# Altium schematic sheet TYPEC_PWR.SchDoc
size A2; DrawnBy: UKAYACIK; Engineer: UKAYACIK; DocumentNumber: 15; SheetNumber: 15; SheetTotal: 21
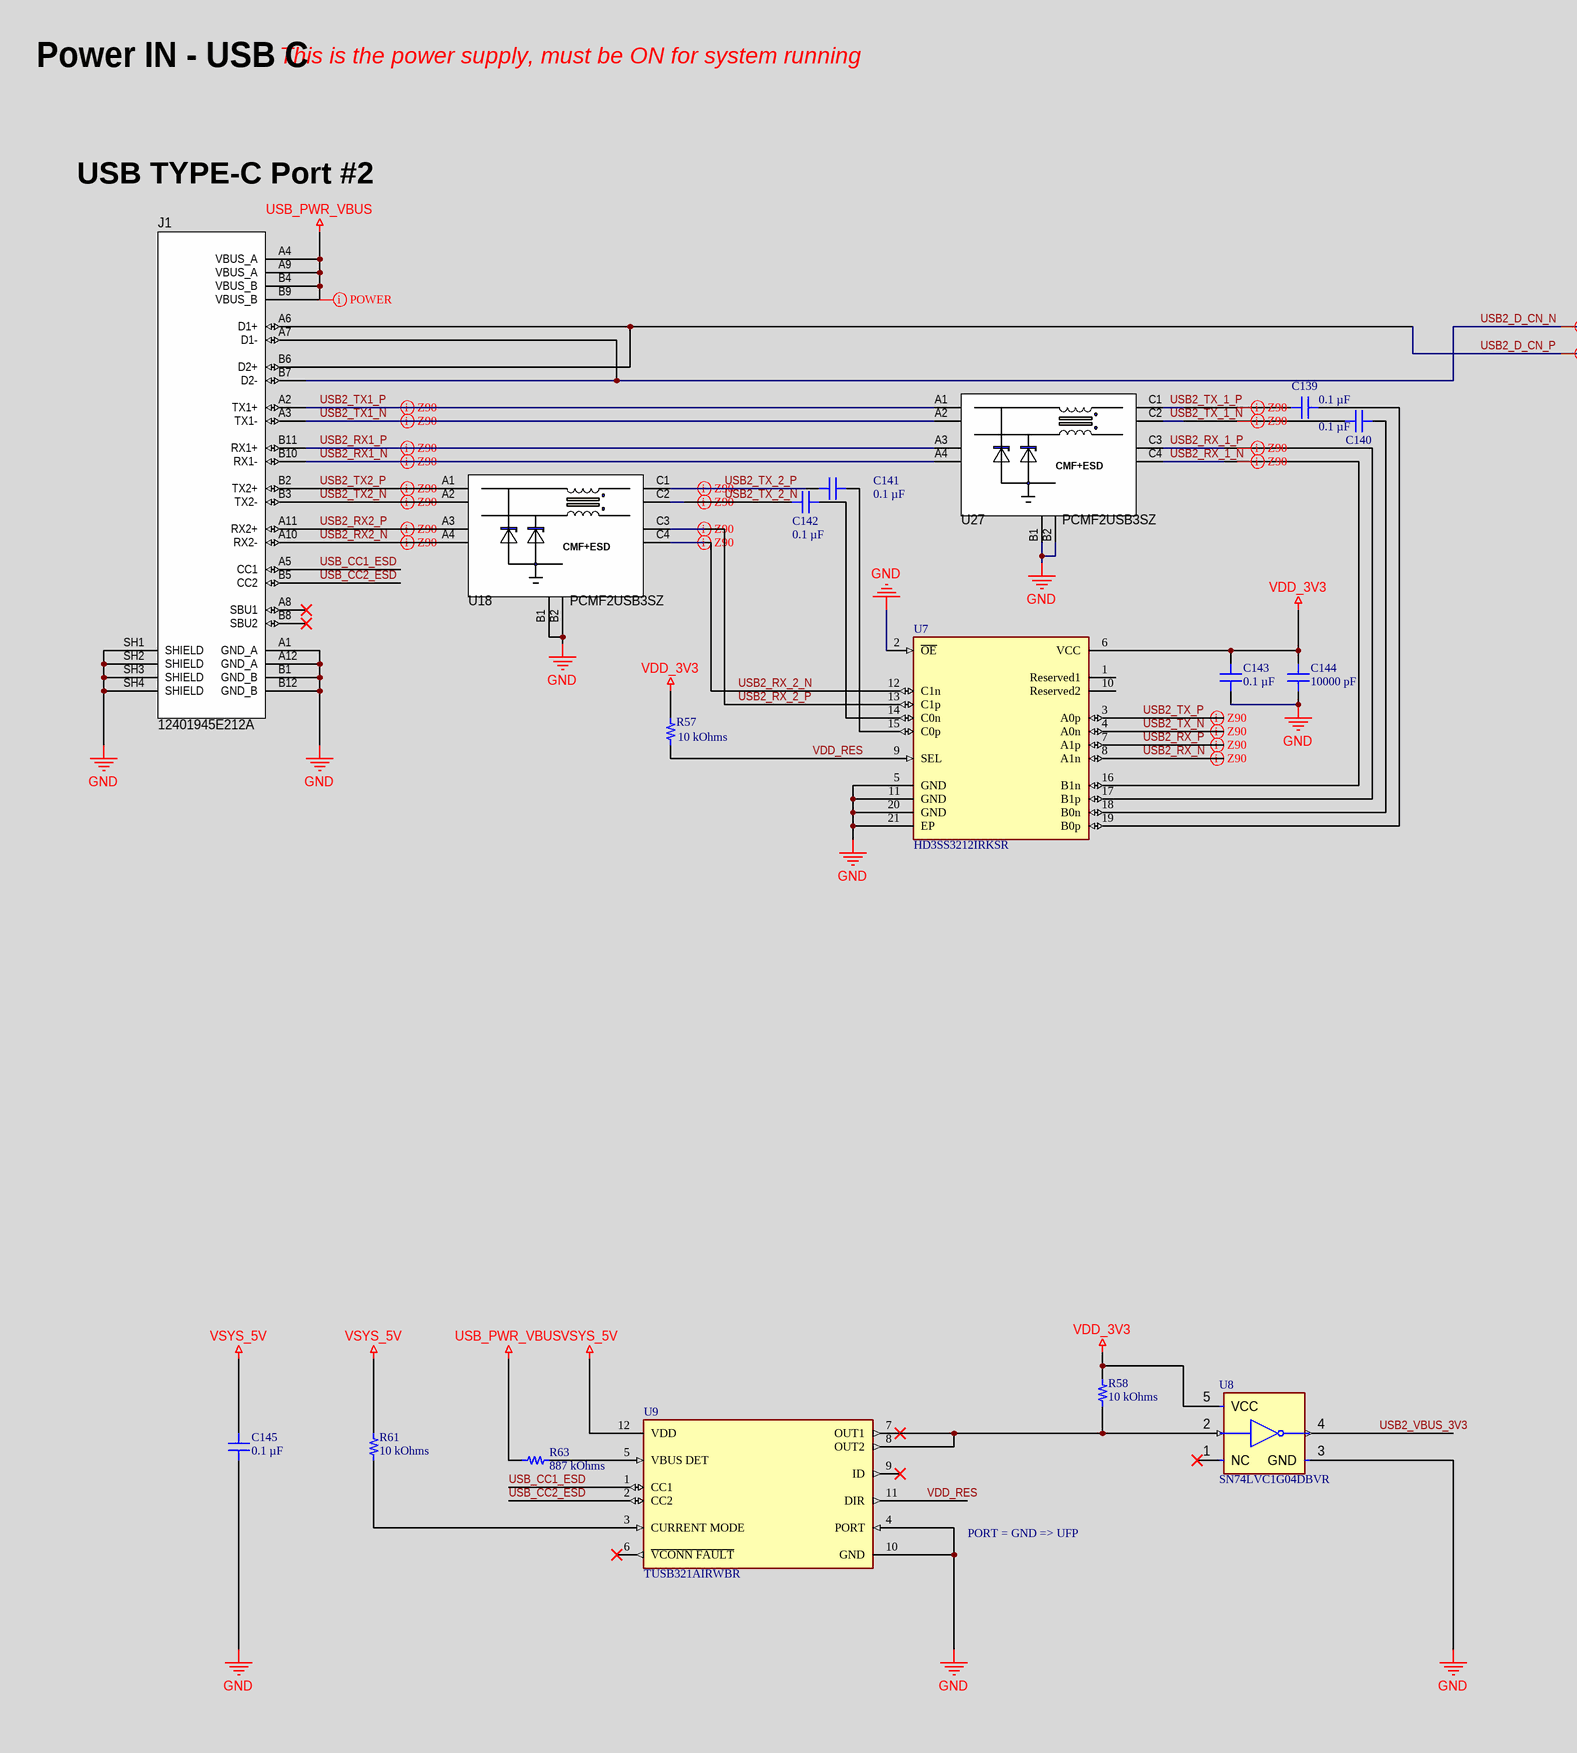
[diagram p0: TYPEC_PWR.SchDoc, left]
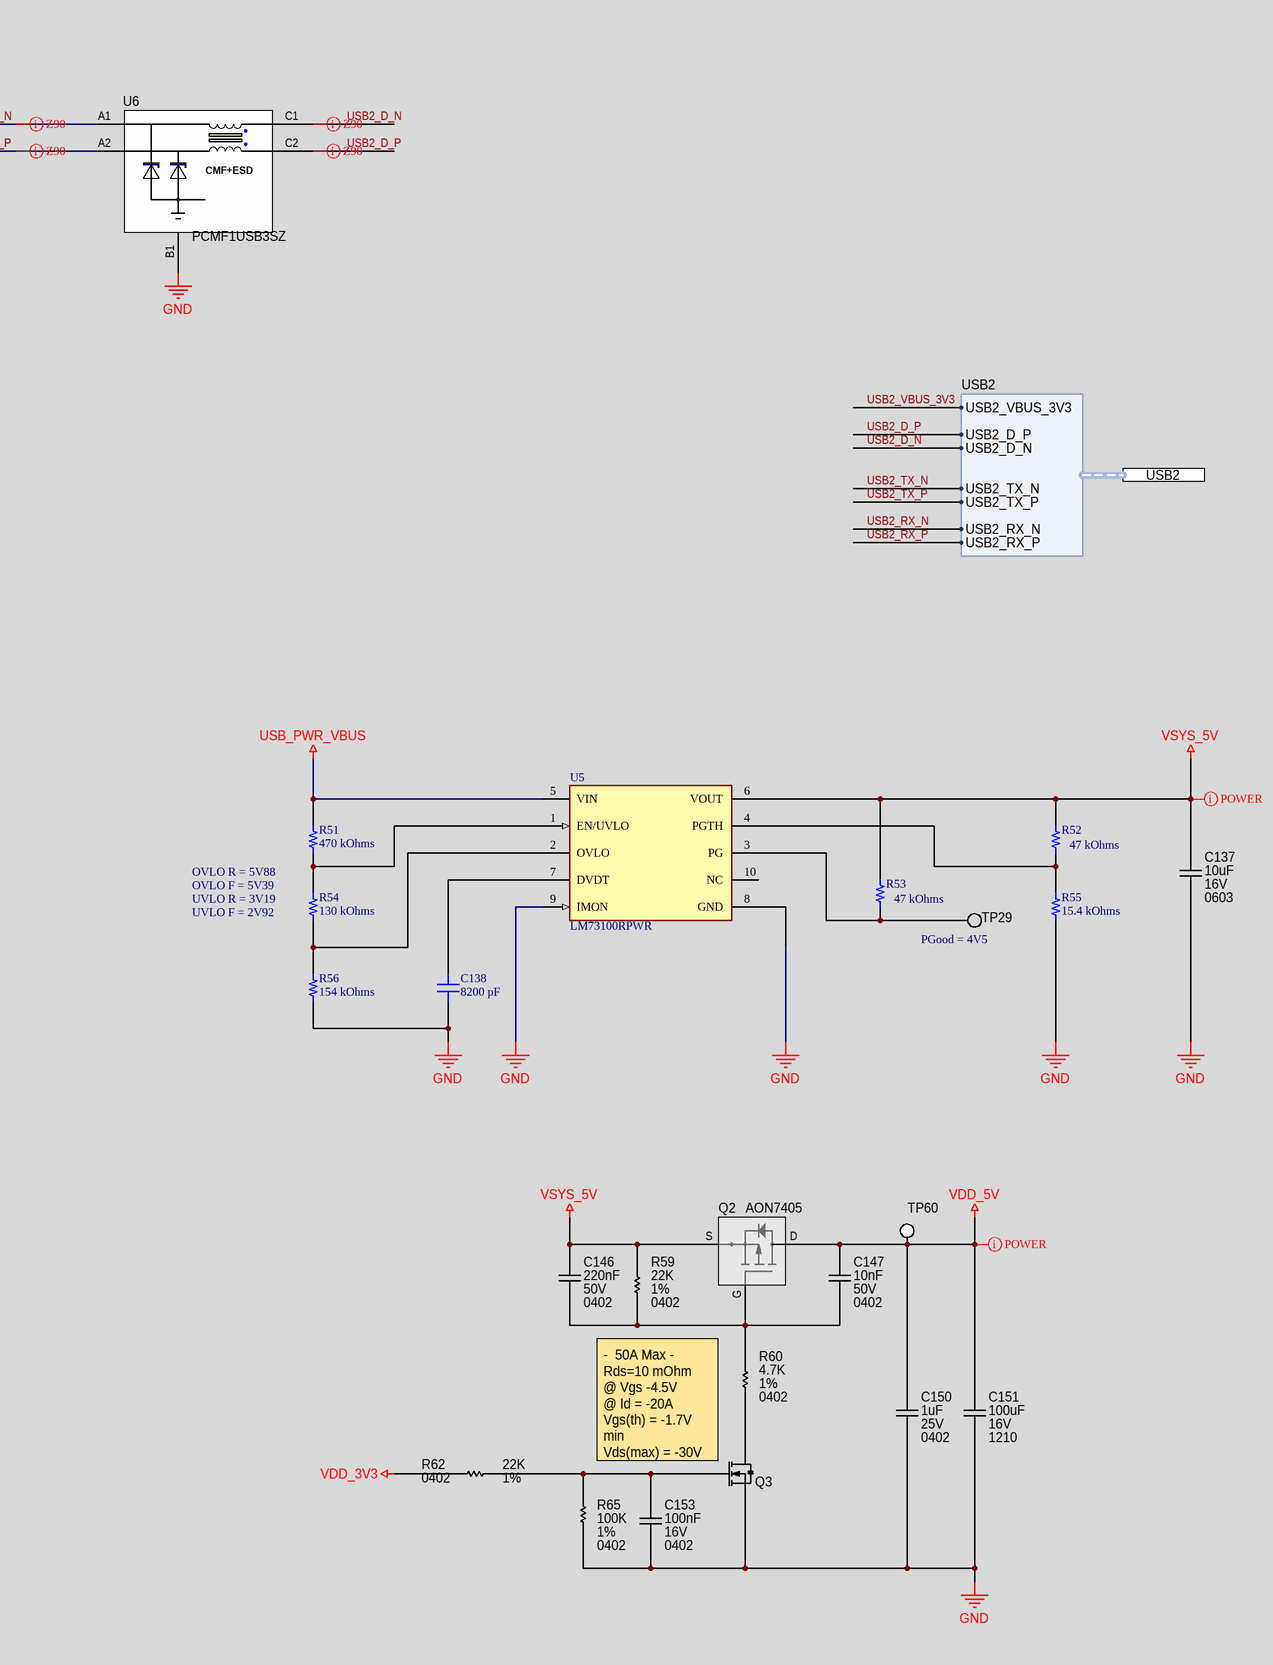
[diagram p1: TYPEC_PWR.SchDoc, right]

## Parts
C137  Voltage Rating: 16V  Capacitance: 10uF  Case/Package: 0603  [CAP_0603_CAPC1608X08N]  (hidden comment: GRM188R61C106MAALD)
C138  8200 pF  [CAP 0402_1005]
C139  0.1 µF  [MURATA GCM155 0402_1005]
C140  0.1 µF  [MURATA GCM155 0402_1005]
C141  0.1 µF  [MURATA GCM155 0402_1005]
C142  0.1 µF  [MURATA GCM155 0402_1005]
C143  0.1 µF  [MURATA GCM155 0402_1005]
C144  10000 pF  [CAP 0402_1005]
C145  0.1 µF  [MURATA GCM155 0402_1005]
C146  Case/Package: 0402  Voltage Rating (DC): 50V  Capacitance: 220nF  [CAP_0402_CAPC1005X05N]  (hidden comment: GRM155R61H224KE01W)
C147  Voltage Rating: 50V  Capacitance: 10nF  Case/Package: 0402  [CAP_0402_CAPC1005X05N]  (hidden comment: GRM155R71H103KA88D)
C150  Voltage Rating: 25V  Capacitance: 1uF  Case Code (Imperial): 0402  [CAP_0402_CAPC1005X05N]  (hidden comment: GRM155R61E105KA12D)
C151  Voltage Rating: 16V  Capacitance: 100uF  Case/Package: 1210  [CAP_1210_CAPC3225X270N]  (hidden comment: EMK325ABJ107MM-T)
C153  Voltage Rating: 16V  Capacitance: 100nF  Case/Package: 0402  [CAP_0402_CAPC1005X05N]  (hidden comment: CL05B104KO5NNNC)
J1  12401945E212A  [CONN_USBC_AMPHENOL_12401945E212A]
Q2  AON7405  [TRANS_AON7405]
Q3  NX3008NBKW,115  [TRANS_FET_SOT65P210X110-3N]  (value not drawn)
R51  470 kOhms  [RES 0402_1005]
R52  47 kOhms  [RES 0402_1005]
R53  47 kOhms  [RES 0402_1005]
R54  130 kOhms  [YAGEO RES 0402_1005]
R55  15.4 kOhms  [RES 0402_1005]
R56  154 kOhms  [RES 0402_1005]
R57  10 kOhms  [RES 0402_1005]
R58  10 kOhms  [RES 0402_1005]
R59  Tolerance: 1%  Resistance: 22K  Case/Package: 0402  [RES_0402_RESC1005X04N]  (hidden comment: ERJ-2RKF2202X)
R60  Tolerance: 1%  Case Code (Imperial): 0402  Resistance: 4.7K  [RES_0402_RESC1005X04N]  (hidden comment: ERJ-2RKF4701X)
R61  10 kOhms  [RES 0402_1005]
R62  Tolerance: 1%  Resistance: 22K  Case/Package: 0402  [RES_0402_RESC1005X04N]  (hidden comment: ERJ-2RKF2202X)
R63  887 kOhms  [RES 0805_2012]
R65  Resistance: 100K  Tolerance: 1%  Case/Package: 0402  [RES_0402_RESC1005X04N]  (hidden comment: RC0402FR-07100KL)
TP29  NO COMPONENT  [TP_PAD_0.5MM_SMD_ROUND]  (value not drawn)  (no BOM)
TP60  NO COMPONENT  [TP_PAD_0.8MM_SMD_ROUND]  (value not drawn)  (no BOM)
U5  LM73100RPWR  [FP-RPW0010A-MFG]
U6  PCMF1USB3SZ  [ESD_PESD1USB3BCX]
U7  HD3SS3212IRKSR  [FP-RKS0020A-MFG]
U8  SN74LVC1G04DBVR  [FP-DBV0005A-MFG]
U9  TUSB321AIRWBR  [FP-RWB0012A-MFG]
U18  PCMF2USB3SZ  [ESD_PCMF2USB3SZ]
U27  PCMF2USB3SZ  [ESD_PCMF2USB3SZ]

## Ports
USB2 (harness USB2)

## Harnesses
USB2: USB2_VBUS_3V3, USB2_TX_N, USB2_TX_P, USB2_RX_N, USB2_RX_P, USB2_D_N, USB2_D_P

## Nets
GND: C137.1 C138.1 C143.1 C144.1 C145.1 C150.1 C151.1 C153.1 J1.A1(GND_A) J1.A12(GND_A) J1.B1(GND_B) J1.B12(GND_B) J1.SH1(SHIELD) J1.SH2(SHIELD) J1.SH3(SHIELD) J1.SH4(SHIELD) Q3.S R55.1 R56.1 R65.1 U5.8(GND) U5.9(IMON) U6.B1(ground_channel_1) U7.2(~{OE}) U7.5(GND) U7.11(GND) U7.20(GND) U7.21(EP) U8.3(GND) U9.4(PORT) U9.10(GND) U18.B1(GND_CH1) U18.B2(GND_CH2) U27.B1(GND_CH1) U27.B2(GND_CH2)
USB_PWR_VBUS: J1.A4(VBUS_A) J1.A9(VBUS_A) J1.B4(VBUS_B) J1.B9(VBUS_B) R51.2 R63.1 U5.5(VIN)
VDD_3V3: C143.2 C144.2 R57.2 R58.2 R62.1 U7.6(VCC) U8.5(VCC)
VDD_5V: C147.2 C150.2 C151.2 Q2.D TP60.1
VSYS_5V: C137.2 C145.2 C146.2 Q2.S R52.2 R53.2 R59.2 R61.2 U5.6(VOUT) U9.12(VDD)
USB2_D_CN_N: J1.A7(D1-) J1.B7(D2-) U6.A1(channel_1+_external)
USB2_D_CN_P: J1.A6(D1+) J1.B6(D2+) U6.A2(channel_1-_external)
USB2_D_N: U6.C1(channel_1+_internal) ; port USB2.USB2_D_N
USB2_D_P: U6.C2(channel_1-_internal) ; port USB2.USB2_D_P
USB2_RX1_N: J1.B10(RX1-) U27.A4(CH2_IN-)
USB2_RX1_P: J1.B11(RX1+) U27.A3(CH2_IN+)
USB2_RX2_N: J1.A10(RX2-) U18.A4(CH2_IN-)
USB2_RX2_P: J1.A11(RX2+) U18.A3(CH2_IN+)
USB2_RX_1_N: U7.16(B1n) U27.C4(CH2_OUT-)
USB2_RX_1_P: U7.17(B1p) U27.C3(CH2_OUT+)
USB2_RX_2_N: U7.12(C1n) U18.C4(CH2_OUT-)
USB2_RX_2_P: U7.13(C1p) U18.C3(CH2_OUT+)
USB2_RX_N: U7.8(A1n) ; port USB2.USB2_RX_N
USB2_RX_P: U7.7(A1p) ; port USB2.USB2_RX_P
USB2_TX1_N: J1.A3(TX1-) U27.A2(CH1_IN-)
USB2_TX1_P: J1.A2(TX1+) U27.A1(CH1_IN+)
USB2_TX2_N: J1.B3(TX2-) U18.A2(CH1_IN-)
USB2_TX2_P: J1.B2(TX2+) U18.A1(CH1_IN+)
USB2_TX_1_N: C140.1 U27.C2(CH1_OUT-)
USB2_TX_1_P: C139.1 U27.C1(CH1_OUT+)
USB2_TX_2_N: C142.1 U18.C2(CH1_OUT-)
USB2_TX_2_P: C141.1 U18.C1(CH1_OUT+)
USB2_TX_N: U7.4(A0n) ; port USB2.USB2_TX_N
USB2_TX_P: U7.3(A0p) ; port USB2.USB2_TX_P
USB2_VBUS_3V3: U8.4(Y) ; port USB2.USB2_VBUS_3V3
USB_CC1_ESD: J1.A5(CC1) U9.1(CC1)
USB_CC2_ESD: J1.B5(CC2) U9.2(CC2)
VDD_RES: R57.1 U7.9(SEL) U9.11(DIR)
NetC138_2: C138.2 U5.7(DVDT)
NetC139_2: C139.2 U7.19(B0p)
NetC140_2: C140.2 U7.18(B0n)
NetC141_2: C141.2 U7.15(C0p)
NetC142_2: C142.2 U7.14(C0n)
NetC146_1: C146.1 C147.1 Q2.G R59.1 R60.2
NetC153_2: C153.2 Q3.G R62.2 R65.2
NetQ3_D: Q3.D R60.1
NetR51_1: R51.1 R54.2 U5.1(EN/UVLO)
NetR52_1: R52.1 R55.2 U5.4(PGTH)
NetR53_1: R53.1 TP29.1 U5.3(PG)
NetR54_1: R54.1 R56.2 U5.2(OVLO)
NetR58_1: R58.1 U8.2(A) U9.7(OUT1) U9.8(OUT2)
NetR61_1: R61.1 U9.3(CURRENT_MODE)
NetR63_2: R63.2 U9.5(VBUS_DET)

Not connected (* = marked no-connect by the designer): J1 A8(SBU1)* B8(SBU2)*; U5 10(NC); U7 1(Reserved1) 10(Reserved2); U8 1(NC)*; U9 6(~{VCONN_FAULT})* 9(ID)*

## Layout directives
differential pair; differential pair class Z90: USB2_D_CN_N, USB2_D_CN_P, USB2_D_N, USB2_D_P, USB2_RX1_N, USB2_RX1_P, USB2_RX2_N, USB2_RX2_P, USB2_RX_1_N, USB2_RX_1_P, USB2_RX_2_N, USB2_RX_2_P, USB2_RX_N, USB2_RX_P, USB2_TX1_N, USB2_TX1_P, USB2_TX2_N, USB2_TX2_P, USB2_TX_1_N, USB2_TX_1_P, USB2_TX_2_N, USB2_TX_2_P, USB2_TX_N, USB2_TX_P
net class POWER: USB_PWR_VBUS, VDD_5V, VSYS_5V

## Notes on the sheet
- Power IN - USB C
- This is the power supply, must be ON for system running
- USB TYPE-C Port #2
- OVLO R = 5V88
- OVLO F = 5V39
- UVLO R = 3V19
- (near R54) UVLO F = 2V92
- (near TP29) PGood = 4V5
- PORT = GND => UFP
- (near Q3) -  50A Max -
  Rds=10 mOhm
  @ Vgs -4.5V
  @ Id = -20A
  Vgs(th) = -1.7V min
  Vds(max) = -30V
- PCB Des :
- Approv By :
- Project Title :
- Sheet Title :
- Date :
- Page :
- PCB Version :
- PCB Revision :
- Size :
- A2
- (in symbol ESD_EMI_PCMF1USB3SZ) CMF+ESD
- (in symbol ESD_EMI_PCMF2USB3SZ) CMF+ESD

## Library data of the parts
C137 = CAP_10UF_16V_X5R_0603: 0603 10 uF 16 V ±20% Tolerance X5R Multilayer Ceramic Chip Capacitor; Manufacturer: Murata; Manufacturer Part Number: GRM188R61C106MAALD; RoHS: Yes; Category: Ceramic Capacitors; Stock 1: 566627; Pricing 1: 1=0.24000, 10=0.16500, 50=0.11000, 100=0.09340, 500=0.06596, 1000=0.05771 (USD); Mount: Surface Mount; Case Code (Metric): 1608; Material: Ceramic; Case Code (Imperial): 0603; Min Operating Temperature: -55°C; Max Operating Temperature: 85°C; Tolerance: 20%; Packaging: Cut Tape; Voltage Rating (DC): 16V; Length: 0.063inch; Width: 0.031inch; Height: 0.8mm; Thickness: 0.037inch; Lead Free: Lead Free; RoHS Compliant: Yes; ComponentLink1URL: http://search.murata.co.jp/Ceramy/image/img/A01X/G101/ENG/GRM188R61C106MAAL-01.pdf?src-supplier=Digi-Key; ComponentLink1Description: http://search.murata.co.jp/Ceramy/image/img/A01X/G101/ENG/GRM188R61C106MAAL-01.pdf?src-supplier=Digi-Key; ComponentLink2URL: https://search.murata.co.jp/Ceramy/image/img/A01X/G101/ENG/GRM188R61C106MAAL-01.pdf?src-supplier=Digi-Key; ComponentLink2Description: https://search.murata.co.jp/Ceramy/image/img/A01X/G101/ENG/GRM188R61C106MAAL-01.pdf?src-supplier=Digi-Key; ComponentLink3URL: http://search.murata.co.jp/Ceramy/image/img/A01X/partnumbering_e_01.pdf?src-supplier=Digi-Key; ComponentLink3Description: http://search.murata.co.jp/Ceramy/image/img/A01X/partnumbering_e_01.pdf?src-supplier=Digi-Key; Supplier 1: Digi-Key; Supplier 2: Verical; Supplier 3: Mouser; Supplier Part Number 1: 490-10729-1-ND; Supplier Part Number 2: GRM188R61C106MAALD; Supplier Part Number 3: 81-GRM188R61C106MALD
C138 = C0402C822J1RACTU: CAP CER 0402 8.2NF 100VDC X7R; manufacturer: KEMET; Tolerance: ±5%; Voltage - Rated: 100V; Part Number: C0402C822J1RACTU; Capacitance: 8200 pF; Applications: Bypass, Decoupling; componentlink1description: Datasheet; componentlink1url: https://connect.kemet.com:7667/gateway/IntelliData-ComponentDocumentation/1.0/download/datasheet/C0402C822J1RACTU; componentlink2description: DigiKey Link; componentlink2url: https://www.digikey.com/en/products/detail/kemet/C0402C822J1RACTU/19200683; Device Package: 0402 (1005 Metric); lastupdated: 2/9/2024 8:03:16 PM; Lifecycle Status: Active; Minimum Order: 1; Mounting Type: Surface Mount, MLCC; Operating Temperature: -55°C ~ 125°C; Package / Case: 0402 (1005 Metric); packaging: TapeAndReel; partid: 57252; price: 0.02; series: SMD Comm X7R; Size / Dimension: 0.039" L x 0.020" W (1.00mm x 0.50mm); Supplier 1: DigiKey; Supplier Part Number 1: 399-C0402C822J1RACTUCT-ND; Temperature Coefficient: X7R; Thickness (Max): 0.022" (0.55mm); value: 8200 pF
C139-C143 C145 = GCM155R71E104KE02D: CAP CER 0.1UF 25V X7R 0402; manufacturer: Murata Electronics; Tolerance: ±10%; Part Number: GCM155R71E104KE02D; Capacitance: 0.1 µF; Applications: Automotive; componentlink1description: Datasheet; componentlink1url: https://search.murata.co.jp/Ceramy/image/img/A01X/G101/ENG/GCM155R71E104KE02-01.pdf; componentlink2description: DigiKey Link; componentlink2url: https://www.digikey.com/en/products/detail/murata-electronics/GCM155R71E104KE02D/7363175; Device Package: 0402 (1005 Metric); lastupdated: 7/20/2024 2:04:19 AM; Lifecycle Status: Active; Minimum Order: 1; Mounting Type: Surface Mount, MLCC; Operating Temperature: -55°C ~ 125°C; Package / Case: 0402 (1005 Metric); packaging: TapeAndReel; partid: 2051; Part Status: Active; price: 0.01; Ratings: AEC-Q200; series: GCM; Size / Dimension: 0.039" L x 0.020" W (1.00mm x 0.50mm); Supplier 1: DigiKey; Supplier Part Number 1: 490-16431-1-ND; Temperature Coefficient: X7R; Thickness (Max): 0.022" (0.55mm); value: 0.1 µF; Voltage - Rated: 25V
C144 = C0402C103M5RECAUTO: CAP CER 0402 10NF 50V X7R 20%; manufacturer: KEMET; Part Number: C0402C103M5RECAUTO; Capacitance: 10000 pF; Applications: Automotive, ESD Protection; componentlink1description: Datasheet; componentlink1url: https://api.kemet.com/component-edge/download/datasheet/C0402C103M5RECAUTO.pdf; componentlink2description: DigiKey Link; componentlink2url: https://www.digikey.com/en/products/detail/kemet/C0402C103M5RECAUTO/8646509; Device Package: 0402 (1005 Metric); lastupdated: 2/9/2024 8:04:13 PM; Lifecycle Status: Active; Minimum Order: 1; Mounting Type: Surface Mount, MLCC; Operating Temperature: -55°C ~ 125°C; Package / Case: 0402 (1005 Metric); packaging: TapeAndReel; partid: 33125; Part Status: Active; price: 0.01; Ratings: AEC-Q200; series: ESD SMD Auto X7R; Size / Dimension: 0.039" L x 0.020" W (1.00mm x 0.50mm); Supplier 1: DigiKey; Supplier Part Number 1: 399-C0402C103M5RECAUTOCT-ND; Temperature Coefficient: X7R; Thickness (Max): 0.022" (0.55mm); Tolerance: ±20%; value: 10000 pF; Voltage - Rated: 50V
C146 = CAP_0.22UF_50V_X5R_0402: Multilayer Ceramic Capacitor, 0.22 uF, 50 VDC, ± 10%, X5R, 0402 [1005 Metric]; Manufacturer: Murata; Material: 4241ConductorMaterial; Dielectric: 1537DielectricType; Supplier 1: Digi-Key; Manufacturer Part Number: GRM155R61H224KE01W; RoHS: No; Category: Ceramic Capacitors; Stock 1: 74638; Pricing 1: 1=0.1, 10=0.048, 50=0.0272, 100=0.0212, 500=0.01592, 1000=0.01251, 2500=0.01138, 5000=0.01046 (USD); Min Operating Temperature: -55°C; Max Operating Temperature: 85°C; Voltage Rating: 50V; Length: 1mm; Width: 500um; Height: 550um; Thickness: 500um; Supplier Part Number 1: 490-GRM155R61H224KE01WCT-ND
C147 = CAP_10nF_50V_X7R_0402: Multilayer Ceramic Capacitors MLCC Surface Mount 0402 0.01uF 50 Volts X7R 10%; Manufacturer: Murata; Voltage: 25V; Supplier 1: Digikey; Manufacturer Part Number: GRM155R71H103KA88D; RoHS: Yes; Category: Ceramic Capacitors; Stock 1: 5190059; Pricing 1: 1=0.1, 10=0.023, 50=0.013, 100=0.0101, 500=0.0076, 1000=0.00598, 2500=0.00543, 5000=0.005 (USD); Mount: Surface Mount; Number of Pins: 2; Case Code (Metric): 1005; Case Code (Imperial): 0402; Material: Ceramic; Min Operating Temperature: -55°C; Max Operating Temperature: 125°C; Tolerance: 10%; Packaging: Tape and Reel; Package Quantity: 1; Dielectric: X7R; Termination: SMD/SMT; Series: GRM; Construction: Flat; Voltage Rating (DC): 50V; Length: 1mm; Width: 0.02inch; Height: 0.5mm; Thickness: 0.022inch; Depth: 0.5mm; Radiation Hardening: No; Reach SVHC Compliant: No; RoHS Compliant: Yes; Lead Free: 5697LeadFree; ComponentLink1URL: https://datasheet.ciiva.com/22698/1747449-22698420.pdf?src-supplier=Element14; ComponentLink1Description: https://datasheet.ciiva.com/22698/1747449-22698420.pdf?src-supplier=Element14; ComponentLink2URL: https://datasheet.ciiva.com/19476/1856433-19476546.pdf?src-supplier=Jameco; ComponentLink2Description: https://datasheet.ciiva.com/19476/1856433-19476546.pdf?src-supplier=Jameco; ComponentLink3URL: https://datasheet.ciiva.com/129/product-129810.pdf?src-supplier=Digikey; ComponentLink3Description: https://datasheet.ciiva.com/129/product-129810.pdf?src-supplier=Digikey; ComponentLink4URL: https://datasheet.ciiva.com/11786/0900766b80ef921d-11786340.pdf?src-supplier=Rs; ComponentLink4Description: https://datasheet.ciiva.com/11786/0900766b80ef921d-11786340.pdf?src-supplier=Rs; ComponentLink5URL: https://datasheet.ciiva.com/18100/getdatasheetpartid-27434-18100660.pdf?src-supplier=Verical; ComponentLink5Description: https://datasheet.ciiva.com/18100/getdatasheetpartid-27434-18100660.pdf?src-supplier=Verical; ComponentLink6URL: https://datasheet.ciiva.com/29199/454225-da-01-en-vs-kondensator-0402-29199740.pdf?src-supplier=Conrad; ComponentLink6Description: https://datasheet.ciiva.com/29199/454225-da-01-en-vs-kondensator-0402-29199740.pdf?src-supplier=Conrad; ComponentLink7URL: https://datasheet.ciiva.com/129/grm155r71h103ka88-01-129811.pdf?src-supplier=Digikey; ComponentLink7Description: https://datasheet.ciiva.com/129/grm155r71h103ka88-01-129811.pdf?src-supplier=Digikey; ComponentLink8URL: https://datasheet.ciiva.com/129/grm155r71h103ka88-01-129812.pdf?src-supplier=Digikey; ComponentLink8Description: https://datasheet.ciiva.com/129/grm155r71h103ka88-01-129812.pdf?src-supplier=Digikey; ComponentLink9URL: https://datasheet.ciiva.com/5410/product-5410990.pdf?src-supplier=Mouser; ComponentLink9Description: https://datasheet.ciiva.com/5410/product-5410990.pdf?src-supplier=Mouser; ComponentLink10URL: https://datasheet.ciiva.com/16495/product-16495290.pdf?src-supplier=Future+Electronics; ComponentLink10Description: https://datasheet.ciiva.com/16495/product-16495290.pdf?src-supplier=Future+Electronics; Supplier Part Number 1: 490-4516-6-ND
C150 = CAP_1UF_25V_X5R_0402: Multilayer Ceramic Capacitor, 1 uF, 25 V, ± 10%, X5R, 0402 [1005 Metric]; Manufacturer: Murata; Supplier 1: Digi-Key; Manufacturer Part Number: GRM155R61E105KA12D; RoHS: Yes; Category: Ceramic Capacitors; Stock 1: 849086; Pricing 1: 1=0.1, 10=0.043, 50=0.0246, 100=0.019, 500=0.01434, 1000=0.01126, 2500=0.01024, 5000=0.00942 (USD); Mount: Surface Mount; Case/Package: 0402; Case Code (Metric): 1005; Material: Ceramic; Weight: 0.000212oz; Min Operating Temperature: -55°C; Max Operating Temperature: 85°C; Tolerance: 10%; Packaging: Cut Tape; Dielectric: X5R; Voltage: 25V; Termination: SMD/SMT; Voltage Rating (DC): 25V; Package Quantity: 10000; Series: GRM; Length: 1mm; Width: 0.5mm; Height: 0.5mm; Thickness: 0.022inch; Depth: 0.5mm; Reach SVHC Compliant: No; Lead Free: Lead Free; RoHS Compliant: Yes; ComponentLink1URL: https://datasheet.ciiva.com/7719/1666664-7719006.pdf?src-supplier=Element14; ComponentLink1Description: https://datasheet.ciiva.com/7719/1666664-7719006.pdf?src-supplier=Element14; ComponentLink2URL: https://datasheet.ciiva.com/22732/1666664-22732122.pdf?src-supplier=Element14; ComponentLink2Description: https://datasheet.ciiva.com/22732/1666664-22732122.pdf?src-supplier=Element14; Supplier Part Number 1: 490-10017-1-ND
C151 = CAP_100UF_16V_X5R_1210: Multilayer Ceramic Capacitor, 100 uF, 16 V, ± 20%, X5R, 1210 [3225 Metric]; Manufacturer: Taiyo Yuden; Material: 4241ConductorMaterial; Supplier 1: Digikey; Manufacturer Part Number: EMK325ABJ107MM-T; RoHS: Yes; Category: Ceramic Capacitors; Stock 1: 503358; Pricing 1: 1=1.73, 10=1.295, 50=1.1816, 100=0.9681 (USD); Mount: Surface Mount; Case Code (Metric): 3225; Case Code (Imperial): 1210; Min Operating Temperature: -55°C; Max Operating Temperature: 85°C; Tolerance: 20%; Packaging: Tape and Reel; Package Quantity: 500; Voltage Rating (DC): 16V; Dielectric: X5R; Termination: SMD/SMT; Series: M; Length: 3.2mm; Width: 2.5mm; Height: 2.5mm; Reach SVHC Compliant: No; RoHS Compliant: Yes; ComponentLink1URL: http://www.farnell.com/datasheets/1497285.pdf?src-supplier=Farnell; ComponentLink1Description: http://www.farnell.com/datasheets/1497285.pdf?src-supplier=Farnell; Supplier Part Number 1: 587-3152-1-ND
C153 = CAP_100NF_16V_X7R_0402: Multilayer Ceramic Capacitor, 0.1 uF, 16 V, ± 10%, X7R, 0402 [1005 Metric]; Manufacturer: Samsung; Supplier 1: Digi-Key; Manufacturer Part Number: CL05B104KO5NNNC; RoHS: Yes; Category: Ceramic Capacitors; Stock 1: 11081064; Pricing 1: 1=0.1, 10=0.024, 50=0.013, 100=0.0105, 500=0.00752, 1000=0.00592, 2500=0.00538, 5000=0.00495 (USD); Mount: Surface Mount; Case Code (Metric): 1005; Case Code (Imperial): 0402; Material: Ceramic; Min Operating Temperature: -55°C; Max Operating Temperature: 125°C; Tolerance: 10%; Package Quantity: 1; Packaging: Tape and Reel; Dielectric: X7R; Series: CL; Voltage: 16V; Voltage Rating (DC): 16V; Construction: Flat; Length: 1mm; Width: 0.02inch; Height: 0.5mm; Thickness: 0.022inch; Depth: 0.5mm; Radiation Hardening: No; RoHS Compliant: Yes; Lead Free: Lead Free; ComponentLink1URL: https://datasheet.ciiva.com/26920/getdatasheetpartid-359683-26920169.pdf?src-supplier=Verical; ComponentLink1Description: https://datasheet.ciiva.com/26920/getdatasheetpartid-359683-26920169.pdf?src-supplier=Verical; ComponentLink2URL: https://datasheet.ciiva.com/29198/458718-da-01-en-vs-kondensator-0402-29198423.pdf?src-supplier=Conrad; ComponentLink2Description: https://datasheet.ciiva.com/29198/458718-da-01-en-vs-kondensator-0402-29198423.pdf?src-supplier=Conrad; ComponentLink3URL: https://datasheet.ciiva.com/16208/cl05b104kq5nnnc-16208343.pdf?src-supplier=Future+Electronics; ComponentLink3Description: https://datasheet.ciiva.com/16208/cl05b104kq5nnnc-16208343.pdf?src-supplier=Future+Electronics; ComponentLink4URL: https://datasheet.ciiva.com/26309/mlcc-catalogdownload2013-eng-26309003.pdf?src-supplier=Distrelec; ComponentLink4Description: https://datasheet.ciiva.com/26309/mlcc-catalogdownload2013-eng-26309003.pdf?src-supplier=Distrelec; Supplier Part Number 1: 1276-1001-6-ND
J1 = CONN_USB_TYPEC_3.2_12401945E212A: USB3.2 GEN1, Type C, Top mount, CH 1.53mm, Dual Row SMT / Tap/Rl; Manufacturer: Amphenol ICC / FCI; Supplier 1: Digikey; Manufacturer Part Number: 12401945E212A; RoHS: No; Category: Connectors; Stock 1: 12310; Pricing 1: 1=1.63, 10=1.415, 25=1.3544, 50=1.3242, 100=1.2641, 250=1.14372, 500=1.05342 (USD); Supplier Part Number 1: 664-12401945E212ACT-ND
Q2 = TRANS_FET_CHA_P: TRAN PMOS 30V 50A DFN3X3EP; CLASS: IC; AGILE_PN: 480-78892; MFG_NAME01: Alpha and Omega Semiconductor; CAD_APPROVED: Yes; PCB Footprint: dfn3p3x3p3_8l_ex; MFG_PN01: AON7405; ROHS: Yes; HEIGHT: 0.8MM
Q3 = TRANS_FET_CH_N_NX3008NBKW,115: Trans MOSFET N-CH 30V 0.35A Automotive 3-Pin SC-70 T/R; Manufacturer: Nexperia; Rise Time: 11ns; Turn-Off Delay Time: 69ns; Turn-On Delay Time: 15ns; Supplier 1: Digikey; Manufacturer Part Number: NX3008NBKW,115; RoHS: Yes; Category: MOSFETs; Stock 1: 784274; Pricing 1: 1=0.35, 10=0.239, 100=0.1169, 500=0.09748, 1000=0.06774 (USD); RoHS Compliant: Yes; ComponentLink1URL: https://www.mouser.com/ds/2/302/NX3008NBKW-1151440.pdf?src-supplier=Mouser; ComponentLink1Description: https://www.mouser.com/ds/2/302/NX3008NBKW-1151440.pdf?src-supplier=Mouser; ComponentLink2URL: http://www.farnell.com/datasheets/1508392.pdf?src-supplier=Farnell; ComponentLink2Description: http://www.farnell.com/datasheets/1508392.pdf?src-supplier=Farnell; ComponentLink3URL: https://assets.nexperia.com/documents/data-sheet/NX3008NBKW.pdf?src-supplier=Digikey; ComponentLink3Description: https://assets.nexperia.com/documents/data-sheet/NX3008NBKW.pdf?src-supplier=Digikey; ComponentLink4URL: https://datasheet.octopart.com/NX3008NBKW%2C115-Nexperia-datasheet-87581391.pdf?src-supplier=LKR; ComponentLink4Description: https://datasheet.octopart.com/NX3008NBKW%2C115-Nexperia-datasheet-87581391.pdf?src-supplier=LKR; ComponentLink5URL: https://datasheet.octopart.com/NX3008NBKW%2C115-Nexperia-datasheet-154583516.pdf?src-supplier=TME; ComponentLink5Description: https://datasheet.octopart.com/NX3008NBKW%2C115-Nexperia-datasheet-154583516.pdf?src-supplier=TME; Supplier Part Number 1: 1727-1280-1-ND
R51 = RMCF0402FT470K: RES 470K OHM 1% 1/16W 0402; Manufacturer: Stackpole Electronics Inc; Power (Watts): 0.063W, 1/16W; Temperature Coefficient: ±100ppm/°C; Part Number: RMCF0402FT470K; Value: 470 kOhms; ComponentLink1Description: Datasheet; ComponentLink1URL: https://www.seielect.com/catalog/sei-rmcf_rmcp.pdf; ComponentLink2Description: DigiKey Link; ComponentLink2URL: https://www.digikey.com/en/products/detail/stackpole-electronics-inc/RMCF0402FT470K/1714746; Composition: Thick Film; Device Package: 0402 (1005 Metric); Features: Automotive AEC-Q200; Height - Seated (Max): 0.016" (0.40mm); LastUpdated: 2/9/2024 8:30:13 PM; Lifecycle Status: Active; Minimum Order: 1; Number of Terminations: 2; Operating Temperature: -55°C ~ 155°C; Package / Case: 0402 (1005 Metric); Packaging: CutTape; PartId: 4954; Part Status: Active; Price: 0.01; Ratings: AEC-Q200; Resistance: 470 kOhms; Series: RMCF; Size / Dimension: 0.039" L x 0.020" W (1.00mm x 0.50mm); Supplier 1: DigiKey; Supplier Part Number 1: RMCF0402FT470KCT-ND; Supplier Device Package: 0402; Tolerance: ±1%
R52 R53 = RMCF0402FT47K0: RES 47K OHM 1% 1/16W 0402; Manufacturer: Stackpole Electronics Inc; Power (Watts): 0.063W, 1/16W; Temperature Coefficient: ±100ppm/°C; Part Number: RMCF0402FT47K0; Value: 47 kOhms; ComponentLink1Description: Datasheet; ComponentLink1URL: https://www.seielect.com/catalog/sei-rmcf_rmcp.pdf; ComponentLink2Description: DigiKey Link; ComponentLink2URL: https://www.digikey.com/en/products/detail/stackpole-electronics-inc/RMCF0402FT47K0/1714749; Composition: Thick Film; Device Package: 0402 (1005 Metric); Features: Automotive AEC-Q200; Height - Seated (Max): 0.016" (0.40mm); LastUpdated: 2/9/2024 8:30:13 PM; Lifecycle Status: Active; Minimum Order: 1; Number of Terminations: 2; Operating Temperature: -55°C ~ 155°C; Package / Case: 0402 (1005 Metric); Packaging: CutTape; PartId: 4957; Part Status: Active; Price: 0.01; Ratings: AEC-Q200; Resistance: 47 kOhms; Series: RMCF; Size / Dimension: 0.039" L x 0.020" W (1.00mm x 0.50mm); Supplier 1: DigiKey; Supplier Part Number 1: RMCF0402FT47K0CT-ND; Supplier Device Package: 0402; Tolerance: ±1%
R54 = RC0402FR-07130KL: RES 130K OHM 1% 1/16W 0402; Manufacturer: Yageo; Power (Watts): 0.063W, 1/16W; Temperature Coefficient: ±100ppm/°C; Part Number: RC0402FR-07130KL; Value: 130 kOhms; ComponentLink1Description: Datasheet; ComponentLink1URL: https://www.yageo.com/upload/media/product/productsearch/datasheet/rchip/PYu-RC_Group_51_RoHS_L_10.pdf; ComponentLink2Description: DigiKey Link; ComponentLink2URL: https://www.digikey.com/en/products/detail/yageo/RC0402FR-07130KL/5280829; Composition: Thick Film; Device Package: 0402 (1005 Metric); Features: Moisture Resistant; Height - Seated (Max): 0.016" (0.40mm); LastUpdated: 7/25/2024 9:18:19 AM; Lifecycle Status: Active; Minimum Order: 1; Number of Terminations: 2; Operating Temperature: -55°C ~ 155°C; Package / Case: 0402 (1005 Metric); Packaging: CutTape; PartId: 2673; Part Status: Active; Price: 0.01; Resistance: 130 kOhms; Series: RC_L; Size / Dimension: 0.039" L x 0.020" W (1.00mm x 0.50mm); Supplier 1: DigiKey; Supplier Part Number 1: YAG2969CT-ND; Supplier Device Package: 0402; Tolerance: ±1%
R55 = RMCF0402FT15K4: RES 15.4K OHM 1% 1/16W 0402; Manufacturer: Stackpole Electronics Inc; Power (Watts): 0.063W, 1/16W; Temperature Coefficient: ±100ppm/°C; Part Number: RMCF0402FT15K4; Value: 15.4 kOhms; ComponentLink1Description: Datasheet; ComponentLink1URL: https://www.seielect.com/catalog/sei-rmcf_rmcp.pdf; ComponentLink2Description: DigiKey Link; ComponentLink2URL: https://www.digikey.com/en/products/detail/stackpole-electronics-inc/RMCF0402FT15K4/1714446; Composition: Thick Film; Device Package: 0402 (1005 Metric); Features: Automotive AEC-Q200; Height - Seated (Max): 0.016" (0.40mm); LastUpdated: 2/9/2024 8:29:35 PM; Lifecycle Status: Active; Minimum Order: 1; Number of Terminations: 2; Operating Temperature: -55°C ~ 155°C; Package / Case: 0402 (1005 Metric); Packaging: CutTape; PartId: 17232; Part Status: Active; Price: 0.01; Ratings: AEC-Q200; Resistance: 15.4 kOhms; Series: RMCF; Size / Dimension: 0.039" L x 0.020" W (1.00mm x 0.50mm); Supplier 1: DigiKey; Supplier Part Number 1: RMCF0402FT15K4CT-ND; Supplier Device Package: 0402; Tolerance: ±1%
R56 = RMCF0402FT154K: RES 154K OHM 1% 1/16W 0402; Manufacturer: Stackpole Electronics Inc; Power (Watts): 0.063W, 1/16W; Temperature Coefficient: ±100ppm/°C; Part Number: RMCF0402FT154K; Value: 154 kOhms; ComponentLink1Description: Datasheet; ComponentLink1URL: https://www.seielect.com/catalog/sei-rmcf_rmcp.pdf; ComponentLink2Description: DigiKey Link; ComponentLink2URL: https://www.digikey.com/en/products/detail/stackpole-electronics-inc/RMCF0402FT154K/1714452; Composition: Thick Film; Device Package: 0402 (1005 Metric); Features: Automotive AEC-Q200; Height - Seated (Max): 0.016" (0.40mm); LastUpdated: 2/9/2024 8:29:58 PM; Lifecycle Status: Active; Minimum Order: 1; Number of Terminations: 2; Operating Temperature: -55°C ~ 155°C; Package / Case: 0402 (1005 Metric); Packaging: CutTape; PartId: 9355; Part Status: Active; Price: 0.01; Ratings: AEC-Q200; Resistance: 154 kOhms; Series: RMCF; Size / Dimension: 0.039" L x 0.020" W (1.00mm x 0.50mm); Supplier 1: DigiKey; Supplier Part Number 1: RMCF0402FT154KCT-ND; Supplier Device Package: 0402; Tolerance: ±1%
R57 R58 R61 = MCS0402MC1002FE000: RES SMD 10K OHM 1% 1/10W 0402; Manufacturer: Vishay Beyschlag; Power (Watts): 0.1W, 1/10W; Temperature Coefficient: ±50ppm/°C; Part Number: MCS0402MC1002FE000; Value: 10 kOhms; ComponentLink1Description: Datasheet; ComponentLink1URL: http://www.vishay.com/docs/28760/mcat_pro.pdf; ComponentLink2Description: DigiKey Link; ComponentLink2URL: http://digikey.com/product-detail/en/vishay-beyschlag/MCS0402MC1002FE000/MCS0402-10.0K-MFCT-ND/3883092; Composition: Thin Film; Device Package: 0402 (1005 Metric); Features: Anti-Sulfur, Automotive AEC-Q200; Height - Seated (Max): 0.015" (0.37mm); LastUpdated: 2/9/2024 8:30:21 PM; Lifecycle Status: Active; Minimum Order: 1; Number of Terminations: 2; Operating Temperature: -55°C ~ 175°C; Package / Case: 0402 (1005 Metric); Packaging: TapeAndReel; PartId: 3152; Part Status: Active; Price: 0.03; Ratings: AEC-Q200; Resistance: 10 kOhms; Series: MCS AT - Professional; Size / Dimension: 0.039" L x 0.020" W (1.00mm x 0.50mm); Supplier 1: DigiKey; Supplier Part Number 1: MCS0402-10.0K-MFCT-ND; Supplier Device Package: 0402; Tolerance: ±1%
R59 R62 = RES_22K_1%_100mW_0402: Res Thick Film 0402 22K Ohm 1% 0.1W ±100ppm/°C Molded SMD Punched Carrier T/R; Manufacturer: Panasonic; Power Rating: 100mW; Voltage Rating: 50V; Supplier 1: Mouser; Manufacturer Part Number: ERJ-2RKF2202X; RoHS: Yes; Category: Chip SMD Resistors; Stock 1: 261737; Pricing 1: 1=0.1, 10=0.015, 50=0.015, 100=0.009, 1000=0.007, 10000=0.004 (USD); Mount: Surface Mount; Number of Pins: 2; Contact Plating: Tin; Case Code (Metric): 1005; Min Operating Temperature: -55°C; Max Operating Temperature: 155°C; Resistor Type: Thick Film; Temperature Coefficient: 100ppm/°C; Packaging: Tape and Reel; Package Quantity: 10000; Number of Terminations: 2; Termination: SMD/SMT; Max Power Dissipation: 100mW; Series: ERJ; Resistance Tolerance: 1%; Construction: Rectangular; Technology: THICK FILM; Voltage Rating (DC): 50V; Length: 1mm; Width: 0.5mm; Height: 0.35mm; Depth: 0.5mm; Radiation Hardening: No; Reach SVHC Compliant: Yes; Military Standard: Not; RoHS Compliant: Yes; ComponentLink1URL: https://datasheet.ciiva.com/11821/0900766b80f80784-11821253.pdf?src-supplier=Rs; ComponentLink1Description: https://datasheet.ciiva.com/11821/0900766b80f80784-11821253.pdf?src-supplier=Rs; ComponentLink2URL: https://datasheet.ciiva.com/6138/aoa0000ce2-6138169.pdf?src-supplier=Farnell; ComponentLink2Description: https://datasheet.ciiva.com/6138/aoa0000ce2-6138169.pdf?src-supplier=Farnell; ComponentLink3URL: https://datasheet.ciiva.com/28587/1678782-28587143.pdf?src-supplier=Element14; ComponentLink3Description: https://datasheet.ciiva.com/28587/1678782-28587143.pdf?src-supplier=Element14; ComponentLink4URL: https://datasheet.ciiva.com/46372/1678782-46372858.pdf?src-supplier=Element14; ComponentLink4Description: https://datasheet.ciiva.com/46372/1678782-46372858.pdf?src-supplier=Element14; ComponentLink5URL: https://datasheet.ciiva.com/43511/aoa0000ce2-43511454.pdf?src-supplier=Onlinecomponents.com; ComponentLink5Description: https://datasheet.ciiva.com/43511/aoa0000ce2-43511454.pdf?src-supplier=Onlinecomponents.com; ComponentLink6URL: https://datasheet.ciiva.com/46372/1678782-46372859.pdf?src-supplier=Element14; ComponentLink6Description: https://datasheet.ciiva.com/46372/1678782-46372859.pdf?src-supplier=Element14; ComponentLink7URL: https://datasheet.ciiva.com/24025/aoa0000ce2-24025688.pdf?src-supplier=Mouser; ComponentLink7Description: https://datasheet.ciiva.com/24025/aoa0000ce2-24025688.pdf?src-supplier=Mouser; ComponentLink8URL: https://datasheet.ciiva.com/16771/70260748-16771787.pdf?src-supplier=Allied+Electronics; ComponentLink8Description: https://datasheet.ciiva.com/16771/70260748-16771787.pdf?src-supplier=Allied+Electronics; Supplier Part Number 1: 667-ERJ-2RKF2202X; Case Code (Imperial): 0402
R60 = RES_4.7K_1%_100mW_0402: Res Thick Film 0402 4.7K Ohm 1% 0.1W ±100ppm/°C Molded SMD Punched Carrier T/R; Manufacturer: Panasonic; Power Rating: 100mW; Voltage Rating: 50V; Supplier 1: Digi-Key; Manufacturer Part Number: ERJ-2RKF4701X; RoHS: Yes; Category: Chip SMD Resistors; Stock 1: 2269675; Pricing 1: 1=0.1, 10=0.024, 50=0.015, 100=0.0125, 500=0.00848, 1000=0.00731, 5000=0.00531 (USD); Case Code (Metric): 1005; Weight: 0.000388oz; Min Operating Temperature: -55°C; Max Operating Temperature: 155°C; Temperature Coefficient: 100ppm/°C; Packaging: Cut Tape; Package Quantity: 10000; Termination: SMD/SMT; Voltage Rating (DC): 50V; Series: ERJ-2Rx; Technology: THICK FILM; Length: 1mm; Width: 0.5mm; Height: 0.35mm; Lead Free: Lead Free; RoHS Compliant: Yes; ComponentLink1URL: https://datasheet.ciiva.com/30053/aoa0000ce2-30053990.pdf?src-supplier=Onlinecomponents.com; ComponentLink1Description: https://datasheet.ciiva.com/30053/aoa0000ce2-30053990.pdf?src-supplier=Onlinecomponents.com; ComponentLink2URL: https://datasheet.ciiva.com/7830/aoa0000ce2-7830727.pdf?src-supplier=Element14; ComponentLink2Description: https://datasheet.ciiva.com/7830/aoa0000ce2-7830727.pdf?src-supplier=Element14; ComponentLink3URL: https://datasheet.ciiva.com/22781/1678782-22781576.pdf?src-supplier=Farnell; ComponentLink3Description: https://datasheet.ciiva.com/22781/1678782-22781576.pdf?src-supplier=Farnell; ComponentLink4URL: https://datasheet.ciiva.com/22667/1678782-22667886.pdf?src-supplier=Element14; ComponentLink4Description: https://datasheet.ciiva.com/22667/1678782-22667886.pdf?src-supplier=Element14; ComponentLink5URL: https://datasheet.ciiva.com/22723/1678782-22723903.pdf?src-supplier=Element14; ComponentLink5Description: https://datasheet.ciiva.com/22723/1678782-22723903.pdf?src-supplier=Element14; Supplier Part Number 1: P4.70KLCT-ND
R63 = CRCW0805887KFKEA: RES SMD 887K OHM 1% 1/8W 0805; Manufacturer: Vishay Dale; Power (Watts): 0.125W, 1/8W; Temperature Coefficient: ±100ppm/°C; Part Number: CRCW0805887KFKEA; Value: 887 kOhms; ComponentLink1Description: Datasheet; ComponentLink1URL: http://www.vishay.com/docs/20035/dcrcwe3.pdf; ComponentLink2Description: DigiKey Link; ComponentLink2URL: https://www.digikey.com/en/products/detail/vishay-dale/CRCW0805887KFKEA/1176010; Composition: Thick Film; Device Package: 0805 (2012 Metric); Features: Automotive AEC-Q200; Height - Seated (Max): 0.020" (0.50mm); LastUpdated: 2/8/2024 9:02:16 PM; Lifecycle Status: Active; Minimum Order: 1; Number of Terminations: 2; Operating Temperature: -55°C ~ 155°C; Package / Case: 0805 (2012 Metric); Packaging: TapeAndReel; PartId: 32881; Part Status: Active; Price: 0.01; Ratings: AEC-Q200; Resistance: 887 kOhms; Series: CRCW; Size / Dimension: 0.079" L x 0.049" W (2.00mm x 1.25mm); Supplier 1: DigiKey; Supplier Part Number 1: 541-887KCCT-ND; Supplier Device Package: 0805; Tolerance: ±1%
R65 = RES_100K_1%_100mW_0402: SMD Chip Resistor, 100 kOhm, ± 1%, 63 mW, 0402 [1005 Metric], Thick Film, General Purpose; Manufacturer: Yageo; Temperature Coefficient: 100ppm/°C; Power Rating: 63mW; Voltage Rating: 50V; Supplier 1: Digi-Key; Manufacturer Part Number: RC0402FR-07100KL; RoHS: Yes; Category: Chip SMD Resistors; Stock 1: 27579413; Pricing 1: 1=0.1, 10=0.014, 50=0.0084, 100=0.007, 500=0.00464, 1000=0.00396, 5000=0.00282 (USD); Case Code (Metric): 1005; Case Code (Imperial): 0402; Min Operating Temperature: -55°C; Max Operating Temperature: 155°C; Resistor Type: Thick Film; Packaging: Tape and Reel; Package Quantity: 1; Number of Terminations: 2; Termination: SMD/SMT; Max Power Dissipation: 63mW; Features: Moisture Resistant; Series: RC; Resistance Tolerance: 1%; Construction: Rectangular; Technology: THICK FILM; Voltage Rating (AC): 50V; Length: 0.039inch; Width: 0.02inch; Height: 0.016inch; Depth: 0.5mm; Reach SVHC Compliant: No; RoHS Compliant: Yes; Lead Free: 5697LeadFree; Military Standard: Not; ComponentLink1URL: https://datasheet.ciiva.com/11819/0900766b80c66297-11819452.pdf?src-supplier=Rs; ComponentLink1Description: https://datasheet.ciiva.com/11819/0900766b80c66297-11819452.pdf?src-supplier=Rs; ComponentLink2URL: https://datasheet.ciiva.com/22747/1018594-22747509.pdf?src-supplier=Element14; ComponentLink2Description: https://datasheet.ciiva.com/22747/1018594-22747509.pdf?src-supplier=Element14; ComponentLink3URL: https://datasheet.ciiva.com/2453/pyu-r-int-thick-7-2453362.pdf?src-supplier=Digi-Key; ComponentLink3Description: https://datasheet.ciiva.com/2453/pyu-r-int-thick-7-2453362.pdf?src-supplier=Digi-Key; ComponentLink4URL: https://datasheet.ciiva.com/12667/pyu-rc0402-51-rohs-l-6-r-12667930.pdf?src-supplier=Mouser; ComponentLink4Description: https://datasheet.ciiva.com/12667/pyu-rc0402-51-rohs-l-6-r-12667930.pdf?src-supplier=Mouser; ComponentLink5URL: https://datasheet.ciiva.com/15189/getdatasheetpartid-323696-15189334.pdf?src-supplier=Verical; ComponentLink5Description: https://datasheet.ciiva.com/15189/getdatasheetpartid-323696-15189334.pdf?src-supplier=Verical; ComponentLink6URL: https://datasheet.ciiva.com/2453/pyu-r-int-thick-7-2453363.pdf?src-supplier=Digi-Key; ComponentLink6Description: https://datasheet.ciiva.com/2453/pyu-r-int-thick-7-2453363.pdf?src-supplier=Digi-Key; ComponentLink7URL: https://datasheet.ciiva.com/2453/pyu-r-int-thick-7-2453361.pdf?src-supplier=Digi-Key; ComponentLink7Description: https://datasheet.ciiva.com/2453/pyu-r-int-thick-7-2453361.pdf?src-supplier=Digi-Key; Supplier Part Number 1: 311-100KLRCT-ND
TP29 = TP_PAD_SMD_SMALL: Test Point, SMD pad, round, 1.5mm, 1.6mm, 3mm diameter
TP60 = TP_PAD_SMD_Round: Test Point, SMD pad, round, 1.5mm, 1.6mm, 3mm diameter
U5 = CMP-04910-000122-1: 2.7-V TO 23-V, 5.5-A IDEAL DIODE; RoHS Compliant: Yes
U6 = ESD_EMI_PCMF1USB3SZ: PCMFxUSB3S - Common-mode EMI filter for differential channels with integrated ESD protection; Manufacturer: Nexperia; Supplier 1: Digikey; Manufacturer Part Number: PCMF1USB3SZ; RoHS: Yes; Category: Common Mode Chokes; Stock 1: 25964; Pricing 1: 1=0.5, 10=0.387, 100=0.2321, 500=0.21488, 1000=0.14612, 2000=0.13452 (USD); RoHS Compliant: Yes; ComponentLink1URL: http://www.farnell.com/datasheets/2043701.pdf?src-supplier=Farnell; ComponentLink1Description: http://www.farnell.com/datasheets/2043701.pdf?src-supplier=Farnell; ComponentLink2URL: https://assets.nexperia.com/documents/data-sheet/PCMFXUSB3S_SER.pdf?src-supplier=Digikey; ComponentLink2Description: https://assets.nexperia.com/documents/data-sheet/PCMFXUSB3S_SER.pdf?src-supplier=Digikey; ComponentLink3URL: http://www.farnell.com/datasheets/2043701.pdf?src-supplier=Newark; ComponentLink3Description: http://www.farnell.com/datasheets/2043701.pdf?src-supplier=Newark; ComponentLink4URL: http://www.farnell.com/datasheets/2043701.pdf?src-supplier=Element14; ComponentLink4Description: http://www.farnell.com/datasheets/2043701.pdf?src-supplier=Element14; ComponentLink5URL: https://datasheet.octopart.com/PCMF1USB3SZ-Nexperia-datasheet-137234894.pdf?src-supplier=TME; ComponentLink5Description: https://datasheet.octopart.com/PCMF1USB3SZ-Nexperia-datasheet-137234894.pdf?src-supplier=TME; Supplier Part Number 1: 1727-2508-1-ND
U7 = CMP-04877-000012-1: IC MUX 2:1 8 OHM 20VQFN; USB Standard: USB 3.1; Min Supply Voltage: 3V; Max Supply Voltage: 3.6V; Data Rate: 480Mbps; Number of Ports: 2; Bandwidth: 8GHz; REACH SVHC: No SVHC; Lead Free: Lead Free; Max Operating Temperature: 85°C; Packaging: Tape and Reel; Case/Package: VQFN; Number of Pins: 20; Min Operating Temperature: -40°C
U8 = CMP-0859-00134-4: IC INVERTER 1CH 1-INP SOT23-5; Number of Elements: 1; Turn-On Delay Time: 7.5ns; Propagation Delay: 3.7ns; Max Supply Voltage: 5.5V; Max Output Current: 32mA; Quiescent Current: 10uA; High Level Output Current: -32mA; Schmitt Trigger Input: No; Min Supply Voltage: 1.65V; Number of Circuits: 1; Lead Free: Lead Free; Number of Inputs: 1; Mount: Surface Mount; Length: 3.05mm; Width: 1.75mm; Number of Pins: 5; Case/Package: SOT-23; REACH SVHC: No SVHC; Low Level Output Current: 32mA; Package Quantity: 1; Height: 1.3mm; Radiation Hardening: No; Packaging: Tape and Reel; Output Current: 32mA; Max Operating Temperature: 125°C; Termination: SMD/SMT; Min Operating Temperature: -40°C; Number of Gates: 1; Weight: 0.000557oz; Logic Function: Inverter; Number of Bits: 1; Contact Plating: Tin
U9 = CMP-04877-000015-1: IC INTERFACE SPECIALIZED 12X2QFN; Min Supply Voltage: 4.5V; USB Standard: USB 1.0; Number of Ports: 1; Max Supply Voltage: 5.5V; Packaging: Cut Tape; REACH SVHC: No SVHC; Number of Pins: 12; RoHS Compliant: Yes; Min Operating Temperature: -40°C; Mount: Surface Mount; Lead Free: Lead Free; Max Operating Temperature: 85°C
U18 U27 = ESD_EMI_PCMF2USB3SZ: PCMFxUSB3S - Common-mode EMI filter for differential channels with integrated ESD protection; Manufacturer: Nexperia; Supplier 1: Digikey; Manufacturer Part Number: PCMF2USB3SZ; RoHS: Yes; Category: Common Mode Chokes; Stock 1: 45981; Pricing 1: 1=0.72, 10=0.62, 100=0.4295, 500=0.35888, 1000=0.30542, 2000=0.27202 (USD); RoHS Compliant: Yes; ComponentLink1URL: http://www.farnell.com/datasheets/2043701.pdf?src-supplier=Farnell; ComponentLink1Description: http://www.farnell.com/datasheets/2043701.pdf?src-supplier=Farnell; ComponentLink2URL: http://datasheet.octopart.com/PCMF2USB3SZ-Nexperia-datasheet-97399282.pdf?src-supplier=Rs; ComponentLink2Description: http://datasheet.octopart.com/PCMF2USB3SZ-Nexperia-datasheet-97399282.pdf?src-supplier=Rs; ComponentLink3URL: http://datasheet.octopart.com/PCMF2USB3SZ-Nexperia-datasheet-97399282.pdf?src-supplier=Mouser; ComponentLink3Description: http://datasheet.octopart.com/PCMF2USB3SZ-Nexperia-datasheet-97399282.pdf?src-supplier=Mouser; ComponentLink4URL: http://datasheet.octopart.com/PCMF2USB3SZ-Nexperia-datasheet-97399282.pdf?src-supplier=Avnet; ComponentLink4Description: http://datasheet.octopart.com/PCMF2USB3SZ-Nexperia-datasheet-97399282.pdf?src-supplier=Avnet; ComponentLink5URL: https://datasheet.octopart.com/PCMF2USB3SZ-Nexperia-datasheet-62320956.pdf?src-supplier=Newark; ComponentLink5Description: https://datasheet.octopart.com/PCMF2USB3SZ-Nexperia-datasheet-62320956.pdf?src-supplier=Newark; ComponentLink6URL: https://assets.nexperia.com/documents/data-sheet/PCMFXUSB3S_SER.pdf?src-supplier=Digikey; ComponentLink6Description: https://assets.nexperia.com/documents/data-sheet/PCMFXUSB3S_SER.pdf?src-supplier=Digikey; ComponentLink7URL: http://datasheet.octopart.com/PCMF2USB3SZ-Nexperia-datasheet-97399282.pdf?src-supplier=Digikey; ComponentLink7Description: http://datasheet.octopart.com/PCMF2USB3SZ-Nexperia-datasheet-97399282.pdf?src-supplier=Digikey; ComponentLink8URL: http://datasheet.octopart.com/PCMF2USB3SZ-Nexperia-datasheet-97399282.pdf?src-supplier=Future+Electronics; ComponentLink8Description: http://datasheet.octopart.com/PCMF2USB3SZ-Nexperia-datasheet-97399282.pdf?src-supplier=Future+Electronics; ComponentLink9URL: http://datasheet.octopart.com/PCMF2USB3SZ-Nexperia-datasheet-97399282.pdf?src-supplier=Verical; ComponentLink9Description: http://datasheet.octopart.com/PCMF2USB3SZ-Nexperia-datasheet-97399282.pdf?src-supplier=Verical; ComponentLink10URL: https://datasheet.octopart.com/PCMF2USB3SZ-Nexperia-datasheet-97399282.pdf?src-supplier=LKR; ComponentLink10Description: https://datasheet.octopart.com/PCMF2USB3SZ-Nexperia-datasheet-97399282.pdf?src-supplier=LKR; ComponentLink11URL: https://datasheet.octopart.com/PCMF2USB3SZ-Nexperia-datasheet-137234894.pdf?src-supplier=TME; ComponentLink11Description: https://datasheet.octopart.com/PCMF2USB3SZ-Nexperia-datasheet-137234894.pdf?src-supplier=TME; Supplier Part Number 1: 1727-2509-1-ND